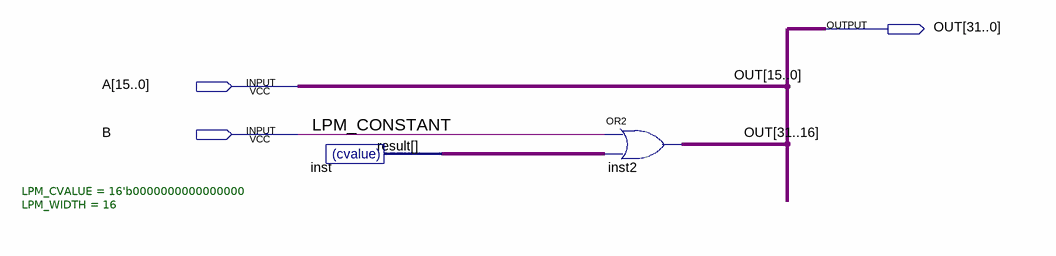
[diagram p0: schematic sheet]
// Quartus schematic signExtend.bdf as structural Verilog: 2 symbols, 3 pins
module signExtend (
  input  [15:0] A,
  input  B,
  output [31:0] OUT
);

  wire [15:0] inst_result;

  LPM_CONSTANT #(.LPM_CVALUE(16'b0000000000000000), .LPM_WIDTH(16)) inst (.result(inst_result));
  assign OUT[31:16] = {16{B}} | inst_result;  // OR2 inst2, 16 bits wide

  assign OUT[15:0] = A;
endmodule
